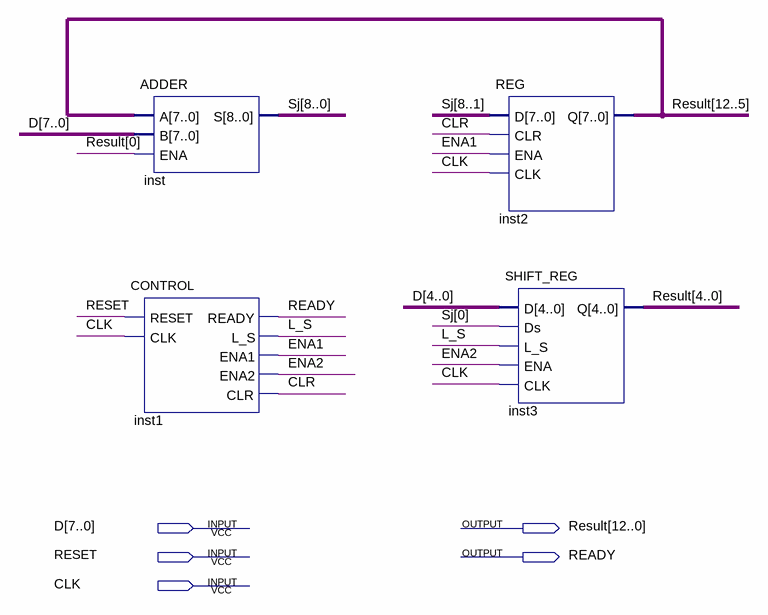
[diagram p0: schematic sheet]
// Quartus schematic mul_A_vs_B.bdf as structural Verilog: 4 symbols, 5 pins
module mul_A_vs_B (
  input  [7:0] D,
  input  RESET,
  input  CLK,
  output [12:0] Result,
  output READY
);

  wire CLR, ENA1, ENA2, L_S;
  wire [8:0] Sj;

  ADDER inst (.A(Result[12:5]), .B(D), .ENA(Result[0]), .S(Sj));
  CONTROL inst1 (.RESET(RESET), .CLK(CLK), .READY(READY), .L_S(L_S), .ENA1(ENA1), .ENA2(ENA2), .CLR(CLR));
  REG inst2 (.D(Sj[8:1]), .CLR(CLR), .ENA(ENA1), .CLK(CLK), .Q(Result[12:5]));
  SHIFT_REG inst3 (.D(D[4:0]), .Ds(Sj[0]), .L_S(L_S), .ENA(ENA2), .CLK(CLK), .Q(Result[4:0]));
endmodule
